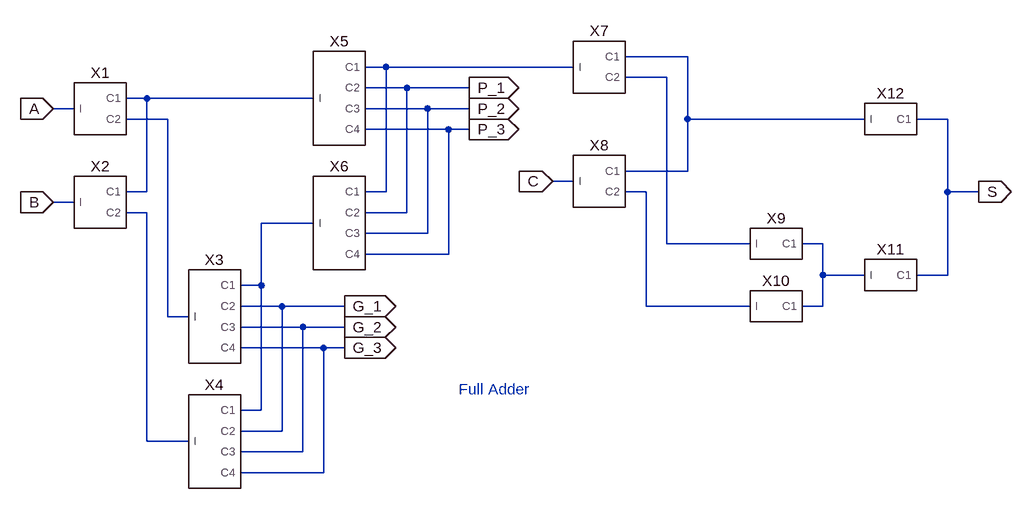
[diagram p0: schematic fag3p3.asc]
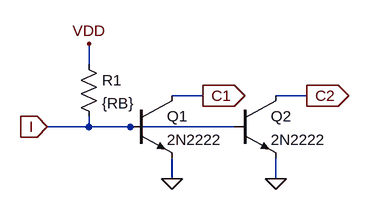
[diagram p1: sub-circuit iilg2.asc]
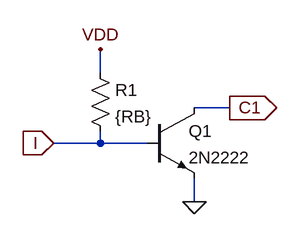
[diagram p2: sub-circuit iilg1.asc]
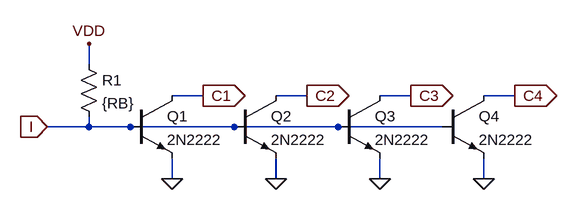
[diagram p3: sub-circuit iilg4.asc]
fag3p3.asc, the LTspice schematic file:
Version 4
SHEET 1 4164 944
WIRE 1264 -320 1168 -320
WIRE 800 -304 768 -304
WIRE 1088 -304 800 -304
WIRE 1232 -288 1168 -288
WIRE 832 -272 768 -272
WIRE 928 -272 832 -272
WIRE 432 -256 400 -256
WIRE 688 -256 432 -256
WIRE 320 -240 288 -240
WIRE 864 -240 768 -240
WIRE 928 -240 864 -240
WIRE 464 -224 400 -224
WIRE 1264 -224 1264 -320
WIRE 1536 -224 1264 -224
WIRE 1664 -224 1616 -224
WIRE 896 -208 768 -208
WIRE 928 -208 896 -208
WIRE 1264 -144 1264 -224
WIRE 1264 -144 1168 -144
WIRE 1088 -128 1056 -128
WIRE 432 -112 432 -256
WIRE 432 -112 400 -112
WIRE 800 -112 800 -304
WIRE 800 -112 768 -112
WIRE 1200 -112 1168 -112
WIRE 1664 -112 1664 -224
WIRE 1712 -112 1664 -112
WIRE 320 -96 288 -96
WIRE 432 -80 400 -80
WIRE 832 -80 832 -272
WIRE 832 -80 768 -80
WIRE 688 -64 608 -64
WIRE 864 -48 864 -240
WIRE 864 -48 768 -48
WIRE 1232 -32 1232 -288
WIRE 1360 -32 1232 -32
WIRE 1472 -32 1440 -32
WIRE 896 -16 896 -208
WIRE 896 -16 768 -16
WIRE 1472 16 1472 -32
WIRE 1536 16 1472 16
WIRE 1664 16 1664 -112
WIRE 1664 16 1616 16
WIRE 608 32 608 -64
WIRE 608 32 576 32
WIRE 640 64 576 64
WIRE 736 64 640 64
WIRE 1200 64 1200 -112
WIRE 1360 64 1200 64
WIRE 1472 64 1472 16
WIRE 1472 64 1440 64
WIRE 464 80 464 -224
WIRE 496 80 464 80
WIRE 672 96 576 96
WIRE 736 96 672 96
WIRE 704 128 576 128
WIRE 736 128 704 128
WIRE 608 224 608 32
WIRE 608 224 576 224
WIRE 640 256 640 64
WIRE 640 256 576 256
WIRE 432 272 432 -80
WIRE 496 272 432 272
WIRE 672 288 672 96
WIRE 672 288 576 288
WIRE 704 320 704 128
WIRE 704 320 576 320
FLAG 288 -240 A
IOPIN 288 -240 In
FLAG 288 -96 B
IOPIN 288 -96 In
FLAG 1056 -128 C
IOPIN 1056 -128 In
FLAG 736 64 G_1
IOPIN 736 64 Out
FLAG 928 -272 P_1
IOPIN 928 -272 Out
FLAG 1712 -112 S
IOPIN 1712 -112 Out
FLAG 736 96 G_2
IOPIN 736 96 Out
FLAG 928 -240 P_2
IOPIN 928 -240 Out
FLAG 736 128 G_3
IOPIN 736 128 Out
FLAG 928 -208 P_3
IOPIN 928 -208 Out
SYMBOL iilg2 352 -240 R0
SYMATTR InstName X1
SYMBOL iilg2 352 -96 R0
SYMATTR InstName X2
SYMBOL iilg2 1120 -304 R0
SYMATTR InstName X7
SYMBOL iilg1 1392 -32 R0
SYMATTR InstName X9
SYMBOL iilg1 1392 64 R0
SYMATTR InstName X10
SYMBOL iilg1 1568 16 R0
SYMATTR InstName X11
SYMBOL iilg1 1568 -224 R0
SYMATTR InstName X12
SYMBOL iilg2 1120 -128 R0
SYMATTR InstName X8
SYMBOL iilg4 528 80 R0
SYMATTR InstName X3
SYMBOL iilg4 528 272 R0
SYMATTR InstName X4
SYMBOL iilg4 720 -256 R0
SYMATTR InstName X5
SYMBOL iilg4 720 -64 R0
SYMATTR InstName X6
TEXT 912 192 Left 2 ;Full Adder

iilg2.asc, the sub-circuit schematic file:
Version 4
SHEET 1 880 680
WIRE 384 240 384 208
WIRE 560 288 512 288
WIRE 720 288 672 288
WIRE 384 336 384 320
WIRE 384 336 320 336
WIRE 448 336 384 336
WIRE 608 336 448 336
WIRE 512 416 512 384
WIRE 672 416 672 384
FLAG 384 208 VDD
FLAG 320 336 I
IOPIN 320 336 In
FLAG 512 416 0
FLAG 560 288 C1
IOPIN 560 288 Out
FLAG 672 416 0
FLAG 720 288 C2
IOPIN 720 288 Out
SYMBOL npn 448 288 R0
SYMATTR InstName Q1
SYMATTR Value 2N2222
SYMBOL res 368 224 R0
SYMATTR InstName R1
SYMATTR Value {RB}
SYMBOL npn 608 288 R0
SYMATTR InstName Q2
SYMATTR Value 2N2222

iilg1.asc, the sub-circuit schematic file:
Version 4
SHEET 1 880 680
WIRE 384 240 384 208
WIRE 560 288 512 288
WIRE 384 336 384 320
WIRE 384 336 320 336
WIRE 448 336 384 336
WIRE 512 416 512 384
FLAG 512 416 0
FLAG 384 208 VDD
FLAG 320 336 I
IOPIN 320 336 In
FLAG 560 288 C1
IOPIN 560 288 Out
SYMBOL npn 448 288 R0
SYMATTR InstName Q1
SYMATTR Value 2N2222
SYMBOL res 368 224 R0
SYMATTR InstName R1
SYMATTR Value {RB}

iilg4.asc, the sub-circuit schematic file:
Version 4
SHEET 1 1132 680
WIRE 384 240 384 208
WIRE 560 288 512 288
WIRE 720 288 672 288
WIRE 880 288 832 288
WIRE 1040 288 992 288
WIRE 384 336 384 320
WIRE 384 336 320 336
WIRE 448 336 384 336
WIRE 608 336 448 336
WIRE 768 336 608 336
WIRE 928 336 768 336
WIRE 512 416 512 384
WIRE 672 416 672 384
WIRE 832 416 832 384
WIRE 992 416 992 384
FLAG 384 208 VDD
FLAG 320 336 I
IOPIN 320 336 In
FLAG 512 416 0
FLAG 560 288 C1
IOPIN 560 288 Out
FLAG 672 416 0
FLAG 720 288 C2
IOPIN 720 288 Out
FLAG 832 416 0
FLAG 880 288 C3
IOPIN 880 288 Out
FLAG 992 416 0
FLAG 1040 288 C4
IOPIN 1040 288 Out
SYMBOL npn 448 288 R0
SYMATTR InstName Q1
SYMATTR Value 2N2222
SYMBOL res 368 224 R0
SYMATTR InstName R1
SYMATTR Value {RB}
SYMBOL npn 608 288 R0
SYMATTR InstName Q2
SYMATTR Value 2N2222
SYMBOL npn 768 288 R0
SYMATTR InstName Q3
SYMATTR Value 2N2222
SYMBOL npn 928 288 R0
SYMATTR InstName Q4
SYMATTR Value 2N2222

The netlist it stands for:
* fag3p3.asc
XX1 A N004 N005 iilg2
XX2 B N004 N007 iilg2
XX7 N002 N001 N003 iilg2
XX9 N003 N009 iilg1
XX10 N006 N009 iilg1
XX11 N009 S iilg1
XX12 N001 S iilg1
XX8 C N001 N006 iilg2
XX3 N005 N008 G_1 G_2 G_3 iilg4
XX4 N007 N008 G_1 G_2 G_3 iilg4
XX5 N004 N002 P_1 P_2 P_3 iilg4
XX6 N008 N002 P_1 P_2 P_3 iilg4

* block symbol definitions
.subckt iilg2 I C1 C2
Q1 C1 I 0 0 2N2222
R1 VDD I {RB}
Q2 C2 I 0 0 2N2222
.ends iilg2

.subckt iilg1 I C1
Q1 C1 I 0 0 2N2222
R1 VDD I {RB}
.ends iilg1

.subckt iilg4 I C1 C2 C3 C4
Q1 C1 I 0 0 2N2222
R1 VDD I {RB}
Q2 C2 I 0 0 2N2222
Q3 C3 I 0 0 2N2222
Q4 C4 I 0 0 2N2222
.ends iilg4

.model NPN NPN
.model PNP PNP
.lib standard.bjt
* Full Adder
.backanno
.end